# EAGLE design AC Line detection (EAGLE 9.0.0)
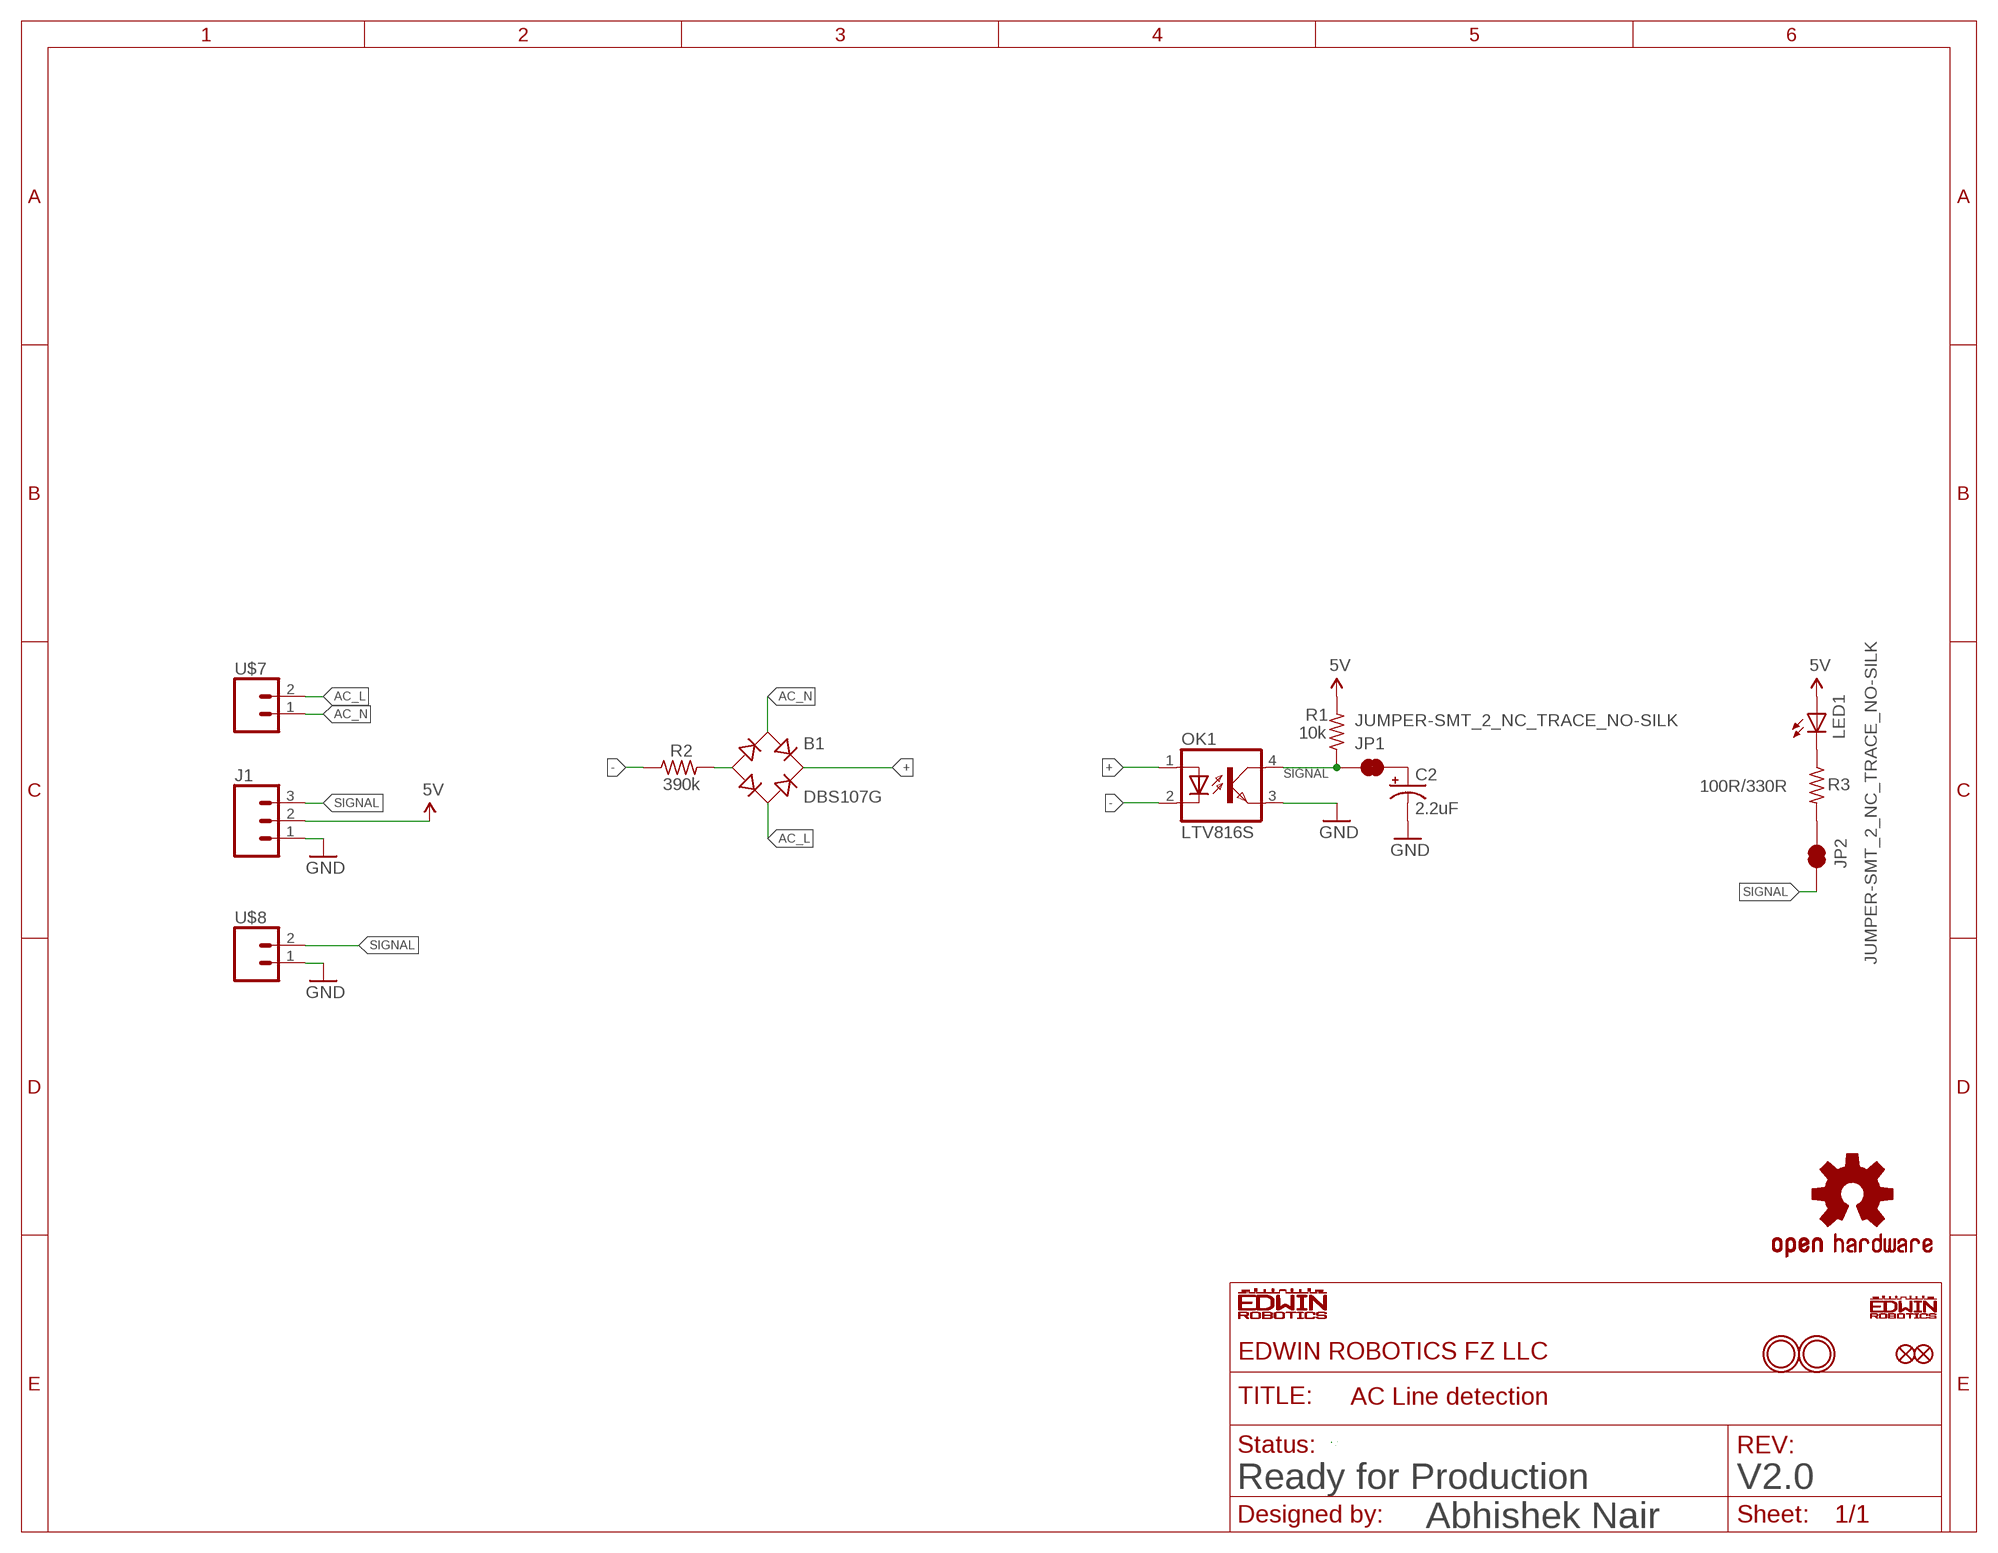
[diagram p0: schematic, sheet 1]

## Parts
B1  DBS107G  [DBS]
C2  2.2uF  CPOL-USCAP-4X5MM  [CAPACITOR-2.2UF_4X5MM_JENNY]
FID1  FIDUCIAL""  [FIDUCIAL_1MM]
FID2  FIDUCIAL""  [FIDUCIAL_1MM]
J1  CONN_03  [1X03]
JP1  JUMPER-SMT_2_NC_TRACE_NO-SILK  [SMT-JUMPER_2_NC_TRACE_NO-SILK]
JP2  JUMPER-SMT_2_NC_TRACE_NO-SILK  [SMT-JUMPER_2_NC_TRACE_NO-SILK]
LED1  LED_TH/SMDCHIPLED_0603  [CHIPLED_0603]
LOGO1  OSHW-LOGOMINI  [OSHW-LOGO-MINI]
OK1  LTV816S  [DIL4-SMD]
R1  10k  R-US_R0603  [R0603]
R2  390k  R-US_R0603  [R0603]
R3  100R/330R  R-US_R0603  [R0603]
U$1  LOGO-9.5MMX4.5MM  [LOGO-9.5MMX4.5MM]
U$5  MOUNTINGHOLE3.0THIN  [MOUNTINGHOLE_3.0_PLATEDTHIN]
U$6  MOUNTINGHOLE3.0THIN  [MOUNTINGHOLE_3.0_PLATEDTHIN]
U$7  SCREW_TERMINALS-2P-5MM  [W237-102]
U$8  SCREW_TERMINALS-2P-5MM  [W237-102]

## Nets
5V: J1.2 LED1.A R1.2
+: B1.+ OK1.1(A)
-: OK1.2(C) R2.1
AC_L: B1.AC2 U$7.2
AC_N: B1.AC1 U$7.1
GND: C2.- J1.1 OK1.3(EMIT) U$8.1
N$1: B1.- R2.2
N$2: C2.+ JP1.2
N$3: LED1.C R3.1
N$4: JP2.1 R3.2
SIGNAL: J1.3 JP1.1 JP2.2 OK1.4(COL) R1.1 U$8.2

## Notes on the sheet
- Ready for Production | V2.0
- Abhishek Nair

## Library data of the parts
B1 = rectifier:DB?*G: Single Phase 1.0 AMP Glass Passivated Bridge Rectifier Taiwan Semiconductor Co.,Ltd. - TSC Source: http://www.taiwansemi.com/TSCbig5/ezcatfiles/cust/img/img/db101g.pdf http://www.ts.com.tw/db/pictures/modules/PDT/PDT060207001/DBLS201G.pdf
C2 = edwinRobotics:CPOL-US: POLARIZED CAPACITOR, American symbol
FID1 FID2 = edwinRobotics:FIDUCIAL: Fiducial Alignment Points Various fiducial points for machine vision alignment.
J1 = edwinRobotics:CONN_03: Multi connection point. Often used as Generic Header-pin footprint for 0.1 inch spaced/style header connections On any of the 0.1 inch spaced packages, you can populate with these: Break Away Headers - Straight <https://www.sparkfun.com/products/116> (PRT-00116) Break Away Male Headers - Right Angle <https://www.sparkfun.com/products/553> (PRT-00553) Female Headers <https://www.sparkfun.com/products/115> (PRT-00115) Break Away Headers - Machine Pin <https://www.sparkfun.com/products/117> (PRT-00117) Break Away Female Headers - Swiss Machine Pin <https://www.sparkfun.com/products/743> (PRT-00743) Stackable Header - 3 Pin (Female, 0.1") <https://www.sparkfun.com/products/13875> (PRT-13875) For SCREWTERMINALS and SPRING TERMINALS visit here: Screw Terimnals on SparkFun.com <https://www.sparkfun.com/search/results?term=Screw+Terminals> (5mm/3.5mm/2.54mm spacing) This device is also useful as a general connection point to wire up your design to another part of your project. Our various solder wires solder well into these plated through hole pads. Hook-Up Wire - Assortment (Stranded, 22 AWG) <https://www.sparkfun.com/products/11375> (PRT-11375) Hook-Up Wire - Assortment (Solid Core, 22 AWG) <https://www.sparkfun.com/products/11367> (PRT-11367) View the entire wire category on our website here <https://www.sparkfun.com/categories/141> Special notes: Molex polarized connector foot print use with SKU : PRT-08232 with associated crimp pins and housings.
JP1 JP2 = edwinRobotics:JUMPER-SMT_2_NC_TRACE: Normally closed trace jumper This jumper has a trace between two pads so it's normally closed (NC). Use a razor knife to open the connection. For best results follow the IPC guidelines for cutting traces: Cutout at least 0.063 mm (0.005 in). Remove all loose material to clean up the cut area. Seal the cut with an approved epoxy. Reapply solder to reclose the connection.
LED1 = edwinRobotics:LED_TH/SMD: LED OSRAM: - CHIPLED LG R971, LG N971, LY N971, LG Q971, LY Q971, LO R971, LY R971 LH N974, LH R974 LS Q976, LO Q976, LY Q976 LO Q996 - Hyper CHIPLED LW Q18S LB Q993, LB Q99A, LB R99A - SideLED LS A670, LO A670, LY A670, LG A670, LP A670 LB A673, LV A673, LT A673, LW A673 LH A674 LY A675 LS A676, LA A676, LO A676, LY A676, LW A676 LS A679, LY A679, LG A679 - Hyper Micro SIDELED® LS Y876, LA Y876, LO Y876, LY Y876 LT Y87S - SmartLED LW L88C, LW L88S LB L89C, LB L89S, LG L890 LS L89K, LO L89K, LY L89K LS L896, LA L896, LO L896, LY L896 - TOPLED LS T670, LO T670, LY T670, LG T670, LP T670 LSG T670, LSP T670, LSY T670, LOP T670, LYG T670 LG T671, LOG T671, LSG T671 LB T673, LV T673, LT T673, LW T673 LH T674 LS T676, LA T676, LO T676, LY T676, LB T676, LH T676, LSB T676, LW T676 LB T67C, LV T67C, LT T67C, LS T67K, LO T67K, LY T67K, LW E67C LS E67B, LA E67B, LO E67B, LY E67B, LB E67C, LV E67C, LT E67C LW T67C LS T679, LY T679, LG T679 LS T770, LO T770, LY T770, LG T770, LP T770 LB T773, LV T773, LT T773, LW T773 LH T774 LS E675, LA E675, LY E675, LS T675 LS T776, LA T776, LO T776, LY T776, LB T776 LHGB T686 LT T68C, LB T68C - Hyper Mini TOPLED® LB M676 - Mini TOPLED Santana® LG M470 LS M47K, LO M47K, LY M47K Source: http://www.osram.convergy.de LUXEON: - LUMILED® LXK2-PW12-R00, LXK2-PW12-S00, LXK2-PW14-U00, LXK2-PW14-V00 LXK2-PM12-R00, LXK2-PM12-S00, LXK2-PM14-U00 LXK2-PE12-Q00, LXK2-PE12-R00, LXK2-PE12-S00, LXK2-PE14-T00, LXK2-PE14-U00 LXK2-PB12-K00, LXK2-PB12-L00, LXK2-PB12-M00, LXK2-PB14-N00, LXK2-PB14-P00, LXK2-PB14-Q00 LXK2-PR12-L00, LXK2-PR12-M00, LXK2-PR14-Q00, LXK2-PR14-R00 LXK2-PD12-Q00, LXK2-PD12-R00, LXK2-PD12-S00 LXK2-PH12-R00, LXK2-PH12-S00 LXK2-PL12-P00, LXK2-PL12-Q00, LXK2-PL12-R00 Source: www.luxeon.com KINGBRIGHT: KA-3528ASYC Source: www.kingbright.com
LOGO1 = edwinRobotics:OSHW-LOGO: Open-Source Hardware (OSHW) Logo This logo indicates the piece of hardware it is found on incorporates a OSHW license and/or adheres to the definition of open source hardware found here: http://freedomdefined.org/OSHW
OK1 = optocoupler:LTV816: OPTO COUPLER Source: LITEON, LTV816.pdf
R1-R3 = edwinRobotics:R-US_: RESISTOR, American symbol
U$1 = edwinRobotics:LOGO-9.5MMX4.5MM
U$5 U$6 = edwinRobotics:MOUNTINGHOLE: Mounting Hole For #2 screws (0.086"/2.18mm width, 0.094"/2.4mm hole) use 2.5mm
U$7 U$8 = edwinRobotics:SCREW_TERMINALS-2P-

## Board
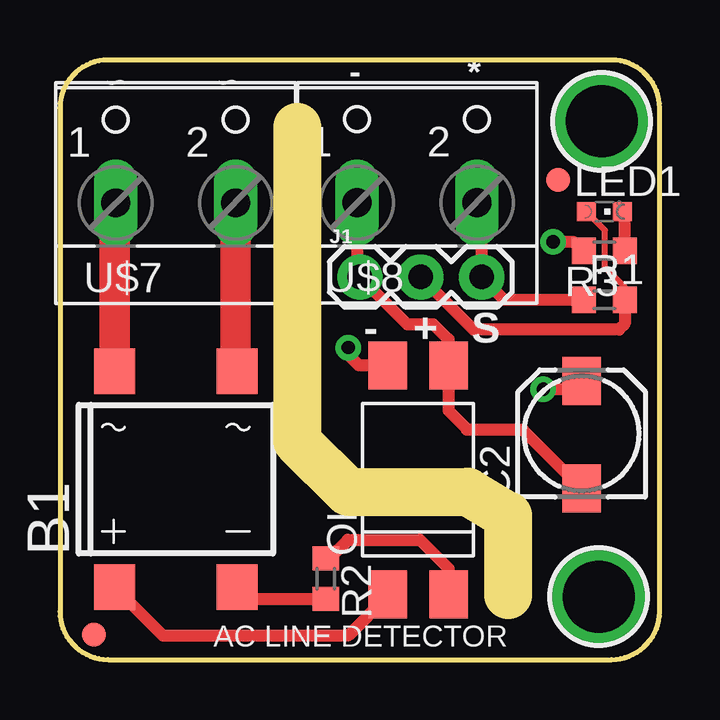
[diagram p1: board, top side]
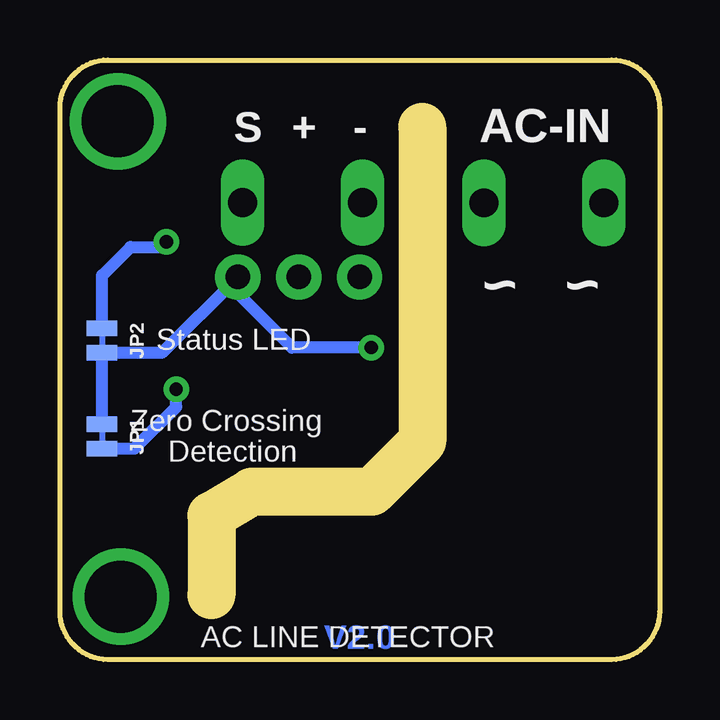
[diagram p2: board, bottom side, seen from below]

Size 25 x 25 mm. Coordinates in mm from the lower left corner, seen from the top.
Outline: 23,25 2,25 arc90 0,23 0,2 arc90 2,0 23,0 arc90 25,2 25,23 arc90 23,25
Copper layers (1*16): Top 0.035mm / dielectric 1.5mm / Bottom 0.035mm
Design rules "ER": minimum track width 8mil, minimum drill 20mil, track to track 8mil, track to pad 8mil, pad to pad 8mil, via to via 8mil, smd to smd 8mil, copper to edge 10mil, drill to drill 8mil, minimum pad ring 12mil, minimum via ring 10mil, stop-mask expansion 4mil, vias tented up to drill 25mil, thermal gap 10mil
Milling: 5 lines

### Footprints (pad centres in the part's own frame; a part is rotated, then mirrored left to right if it is on the bottom)
DBS = smd 1.7 x 1.9: + -2.55,-4.5; - 2.55,-4.5; AC1 -2.55,4.5; AC2 2.55,4.5
CAPACITOR-2.2UF_4X5MM_JENNY = smd 2 x 1.6: + 2.197,-0.004; - -2.289,0.004
FIDUCIAL_1MM = smd 1 x 1: 1 0,0
1X03 = drill 1.016 pad 1.88: 1 0,0; 2 2.54,0; 3 5.08,0
SMT-JUMPER_2_NC_TRACE_NO-SILK = smd 0.635 x 1.27: 1 -0.508,0; 2 0.508,0
CHIPLED_0603 = smd 0.8 x 0.8: A 0,-0.75; C 0,0.75
DIL4-SMD = smd 1.6 x 2: 1 -1.27,-4.77; 2 1.27,-4.77; 3 1.27,4.77; 4 -1.27,4.77
R0603 = smd 1 x 1.1: 1 -0.85,0; 2 0.85,0
MOUNTINGHOLE_3.0_PLATEDTHIN = drill 3 pad 3.6: P$1 0,0
W237-102 = drill 1.194 long: 1 -2.5,-1.27; 2 2.5,-1.27

### Placement (x,y rotation side)
B1  4.83,7.52 0 top
C2  21.75,9.42 90 top
FID1  20.76,20 0 top
FID2  1.41,1.05 0 top
J1  12.5,15.95 0 top
JP1  23.25,9.3 270 bottom
JP2  23.25,13.3 270 bottom
LED1  22.7,18.68 270 top
LOGO1  4.83,8.74 0 bottom
OK1  14.93,7.5 0 top
R1  22.7,15 0 top
R2  11.08,3.38 270 top
R3  22.7,17.05 180 top
U$1  17.23,2.21 0 bottom
U$5  22.46,2.62 0 top
U$6  22.59,22.44 0 top
U$7  4.82,20.31 0 top
U$8  14.89,20.32 0 top

### Tracks (layer width: path | path; a pad name or v marks a point on that pad's centre or on a via)
5V
  Top 0.254: R1.2 23.55,15.53 22.72,16.36 22.72,17.91 LED1.A
  Top 0.508: J1.2 17.24,13.75 23.31,13.75 23.55,13.99 R1.2
+
  Top 0.508: OK1.1 13.66,2.66 12,1 4.3,1 B1.+
-
  Top 0.508: R2.1 11.23,4.23 12,5 15,5 16.2,3.8 OK1.2
AC_L
  Top 1.27: U$7.2 7.32,12.08 B1.AC2
AC_N
  Top 1.27: U$7.1 2.28,19 B1.AC1
GND
  Top 0.508: U$8.1 12.38,16.07 J1.1 14.47,13.98 15.56,13.98 16.2,13.35 OK1.3 16.2,10.38 17,9.58 | C2.- 19.3,9.58 17,9.58 | 17,9.58 16.96,9.58
N$1
  Top 0.508: B1.- 7.87,2.53 R2.2
N$2  (via drill 0.55)
  Top 0.508: v20.15,11.27 21.41,11.27 C2.+
  Bottom 0.508: JP1.2 21.9,8.79 20.15,10.54 v20.15,11.27
N$3
  Top 0.508: R3.1 23.55,18.58 LED1.C
N$4  (via drill 0.55)
  Top 0.508: v20.56,17.42 21.4,17.42 R3.2
  Bottom 0.508: JP2.1 23.25,16.01 22.06,17.2 20.86,17.2 20.56,17.5 | 20.55,17.51 20.56,17.5 | 20.56,17.5 v20.56,17.42
SIGNAL  (via drill 0.55)
  Top 0.508: U$8.2 17.58,18.86 J1.3 18.54,15 R1.1 | OK1.4 12.46,12.27 12.13,12.6 12.13,12.9 v12.02,13.01
  Bottom 0.508: v12.02,13.01 15.33,13.01 17.47,15.15 17.47,15.84 J1.3 20.74,12.79 JP2.2 JP1.1

### Text on the board
Bottom: V2.0
_tsilk: ~ | ~ | - | * | - | + | S | AC LINE DETECTOR
_bsilk: AC-IN | - | + | S | ~ | ~ | Status LED | Zero Crossing | Detection | AC LINE DETECTOR